# EAGLE design beaconv09 (EAGLE 6.1)
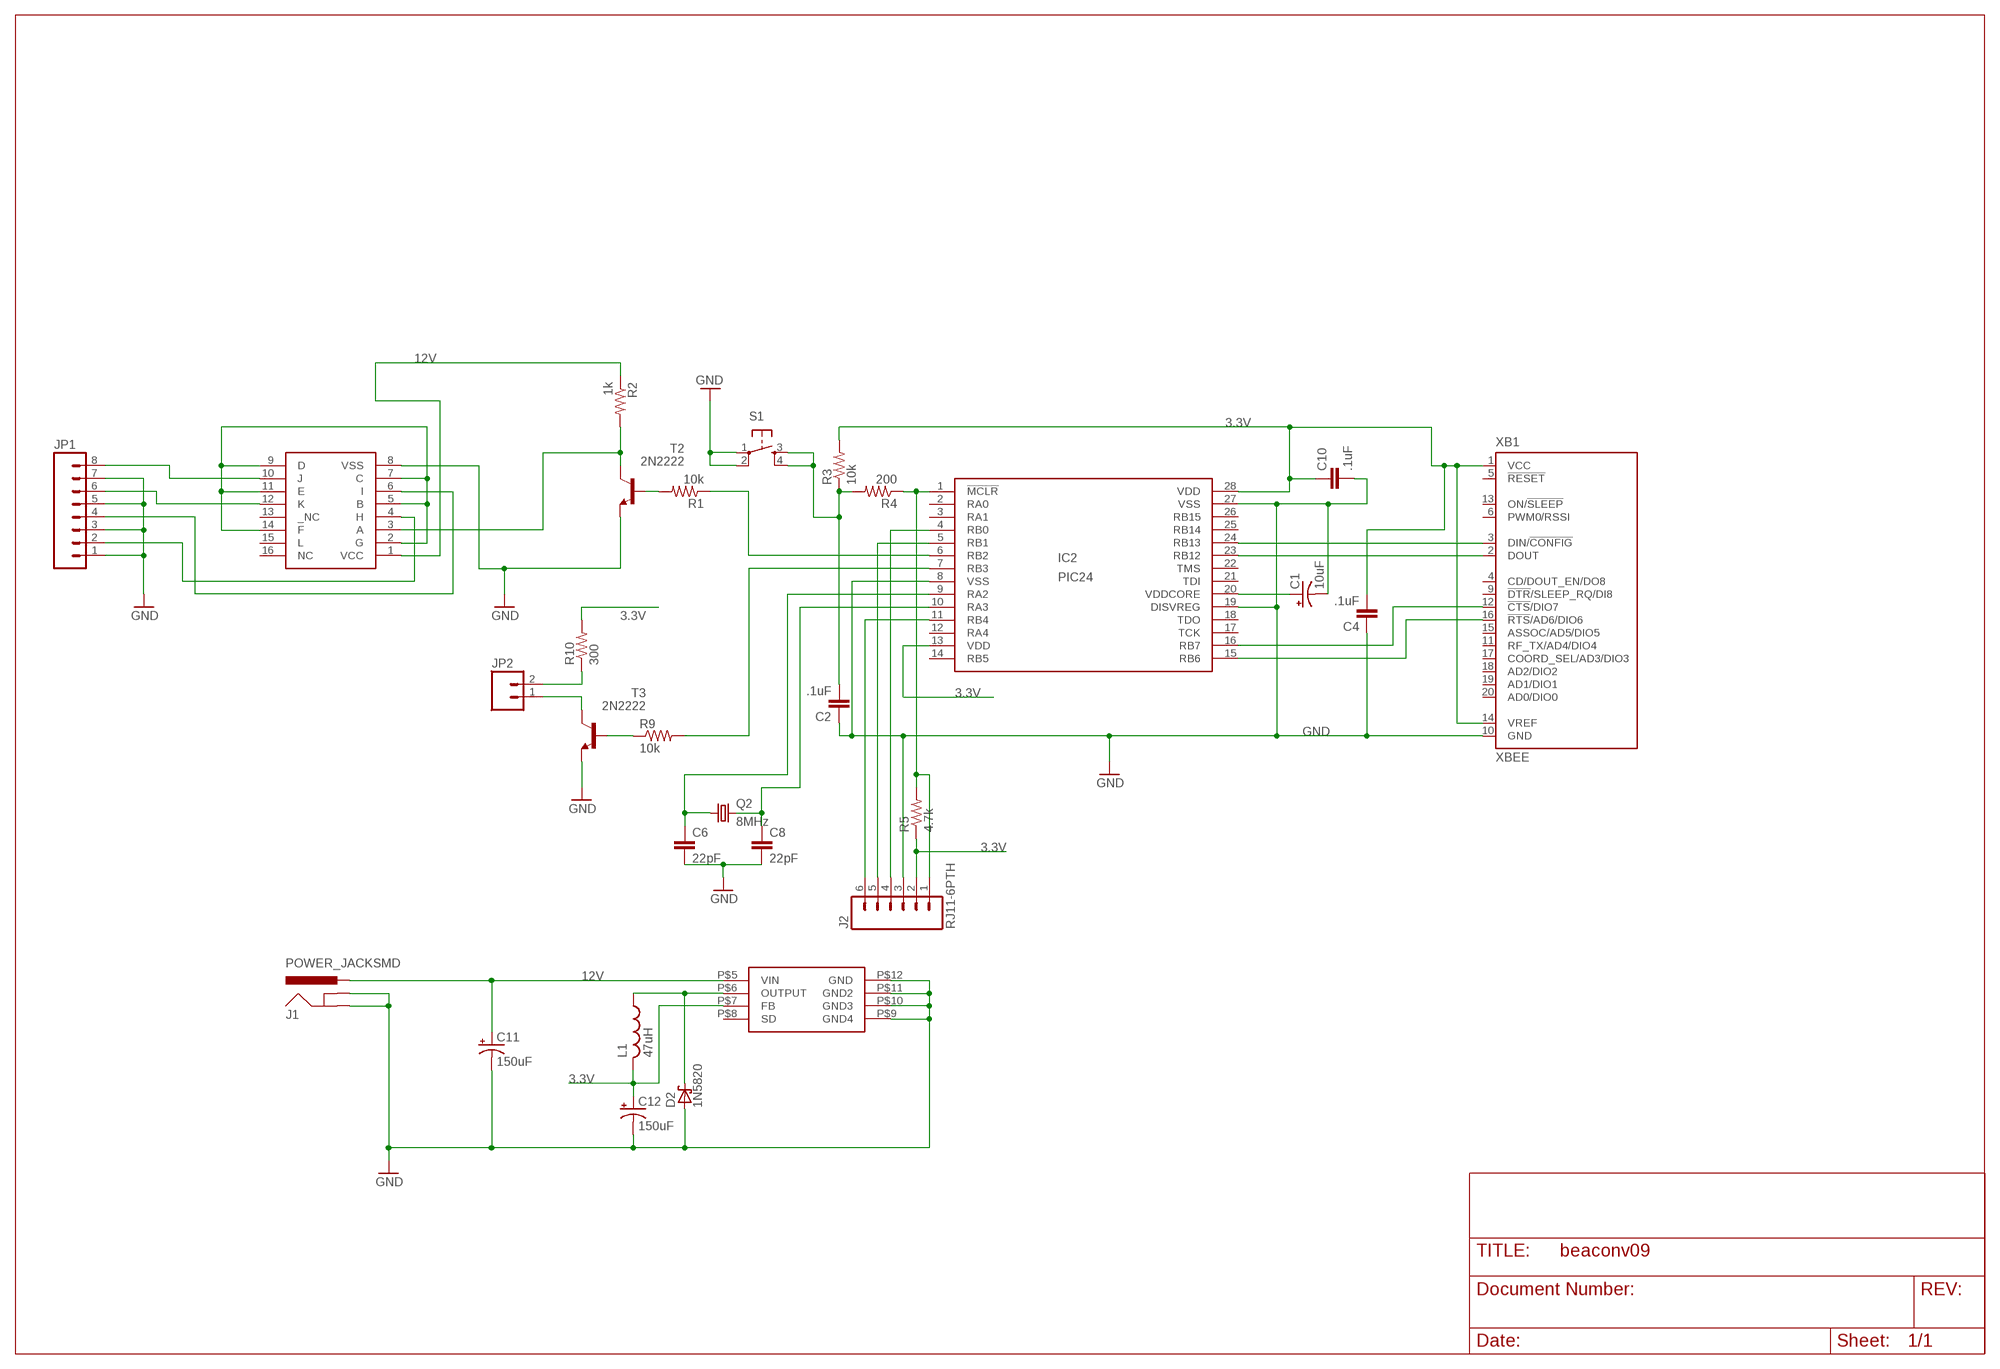
[diagram p0: schematic, sheet 1]

## Parts
AP1509  BUCK1  [BUCK]
C1  10uF  CAP_POL1206  [EIA3216]
C2  .1uF  C-EUC1206  [C1206]
C4  .1uF  C-EUC1206  [C1206]
C6  22pF  C-EUC1206  [C1206]
C8  22pF  C-EUC1206  [C1206]
C10  .1uF  C-EUC1206  [C1206]
C11  150uF  CAP_POL  [ECAPSMPS]
C12  150uF  CAP_POL  [ECAPSMPS]
D2  1N5820  15KEXXD  [DO201T15]
IC2  PIC24  PIC24FJ16GA002  [SO28W]
J1  POWER_JACKSMD  [POWER_JACK_SMD]
J2  RJ11-6PTH  [RJ11-6]
JP1  M08LOCK  [1X08_LOCK]
JP2  M02LOCK  [1X02_LOCK]
L1  47uH  BUCKINDUCTOR  [BUCKINDUCTOR2]
Q2  8MHz  CRYSTALHC49UP  [HC49UP]
R1  10k  RESISTOR1206  [1206]
R2  1k  RESISTOR1206  [1206]
R3  10k  RESISTOR1206  [1206]
R4  200  RESISTOR1206  [1206]
R5  4.7k  R-US_R1206  [R1206]
R9  10k  R-US_R1206  [R1206]
R10  300  R-US_R1206  [R1206]
S1  TAC_SWITCHSMD  [TACTILE_SWITCH_SMD]
T2  2N2222  [TO92-CBE]
T3  2N2222  [TO92-CBE]
U$2  CD4049  [DIL16]
XB1  XBEE  [XBEE]

## Nets
3.3V: AP1509.P$7(FB) C4.2 C10.1 C12.P$1(+) IC2.13(VDD) IC2.28(VDD) J2.2 L1.P$2 R3.2 R5.1 R10.2 XB1.1(VCC) XB1.14(VREF)
12V: AP1509.P$5(VIN) C11.P$1(+) J1.VIN0(PWR) R2.1 U$2.1(VCC)
GND: AP1509.P$9(GND4) AP1509.P$10(GND3) AP1509.P$11(GND2) AP1509.P$12(GND) C1.C(-) C2.1 C4.1 C6.2 C8.2 C10.2 C11.P$2(-) C12.P$2(-) D2.A IC2.8(VSS) IC2.19(DISVREG) IC2.27(VSS) J1.GND(GNDBREAK) J1.P$4(GND) J2.3 JP1.1 JP1.3 JP1.5 JP1.7 S1.1 S1.2 T2.E T3.E U$2.8(VSS) XB1.10(GND)
N$1: IC2.6(RB2) R1.1
N$2: R1.2 T2.B
N$3: JP1.2 U$2.4(H)
N$4: JP2.2 R10.1
N$5: JP1.4 U$2.6(I)
N$6: IC2.23(RB12) XB1.2(DOUT)
N$7: JP1.8 U$2.10(J)
N$8: IC2.24(RB13) XB1.3(DIN/!CONFIG)
N$9: IC2.4(RB0) J2.4
N$10: C1.A(+) IC2.20(VDDCORE)
N$11: C2.2 R3.1 R4.2 S1.3 S1.4
N$12: IC2.1(!MCLR) J2.1 R4.1 R5.2
N$13: IC2.16(RB7) XB1.12(!CTS!/DIO7)
N$14: AP1509.P$6(OUTPUT) D2.C L1.P$1
N$15: R2.2 T2.C U$2.3(A)
N$16: IC2.7(RB3) R9.2
N$17: JP1.6 U$2.12(K)
N$18: JP2.1 T3.C
N$19: IC2.5(RB1) J2.5
N$20: IC2.11(RB4) J2.6
N$21: U$2.2(G) U$2.5(B) U$2.7(C) U$2.9(D) U$2.11(E) U$2.14(F)
N$22: C6.1 IC2.9(RA2) Q2.1
N$23: IC2.15(RB6) XB1.16(!RTS!/AD6/DIO6)
N$24: C8.1 IC2.10(RA3) Q2.2
N$25: R9.1 T3.B
Unconnected: AP1509.P$8(SD) IC2.2(RA0) IC2.3(RA1) IC2.12(RA4) IC2.14(RB5) IC2.17(TCK) IC2.18(TDO) IC2.21(TDI) IC2.22(TMS) IC2.25(RB14) IC2.26(RB15) U$2.13(_NC) U$2.15(L) U$2.16(NC) XB1.4(CD/DOUT_EN/DO8) XB1.5(!RESET) XB1.6(PWM0/RSSI) XB1.9(!DTR!/SLEEP_RQ/DI8) XB1.11(RF_TX/AD4/DIO4) XB1.13(ON/!SLEEP) XB1.15(ASSOC/AD5/DIO5) XB1.17(COORD_SEL/AD3/DIO3) XB1.18(AD2/DIO2) XB1.19(AD1/DIO1) XB1.20(AD0/DIO0)

## Library data of the parts
AP1509 = beacon:BUCK1
C1 = SparkFun-Passives:CAP_POL: Capacitor Polarized These are standard SMD and PTH capacitors. Normally 10uF, 47uF, and 100uF in electrolytic and tantalum varieties. Always verify the external diameter of the through hole cap, it varies with capacity, voltage, and manufacturer. The EIA devices should be standard.
C2 C4 C6 C8 C10 = resistor:C-EU: CAPACITOR, European symbol
C11 C12 = beacon:CAP_POL: Capacitor Polarized These are standard SMD and PTH capacitors. Normally 10uF, 47uF, and 100uF in electrolytic and tantalum varieties. Always verify the external diameter of the through hole cap, it varies with capacity, voltage, and manufacturer. The EIA devices should be standard.
D2 = diode:15KEXXD: DIODE
IC2 = beacon:PIC24FJ16GA002: PIC24FJ16GA002 edit this description Auto generated by make-symbol-device-package-bsdl.ulp Rev. 25 Source: PIC24FJ16GA002.bsd
J1 = SparkFun-Connectors:POWER_JACK: Power Jack This is the standard 5.5mm barrel jack for power. The PTH is the most common, proven, reliable, footprint. All others are experimental. The Slot footprint only works if the mill layer is transmitted to the PCB fab house so be warned. Spark Fun Electronics SKU : PRT-00119. Mating wall wart : TOL-00298 (and others)
J2 = SparkFun-Connectors:RJ11-6: RJ11 Jack Simple 6 pin RJ11 jack. Commonly found on CAT3 devices and Microchip programmers. SKU: PRT-00132
JP1 = SparkFun-Connectors:M08: Header 8 Standard 8-pin 0.1" header. Use with straight break away headers (SKU : PRT-00116), right angle break away headers (PRT-00553), swiss pins (PRT-00743), machine pins (PRT-00117), and female headers (PRT-00115).
JP2 = SparkFun-Connectors:M02: Header 2 Standard 2-pin 0.1" header. Use with straight break away headers (SKU : PRT-00116), right angle break away headers (PRT-00553), swiss pins (PRT-00743), machine pins (PRT-00117), and female headers (PRT-00115). Molex polarized connector foot print use with SKU : PRT-08233 with associated crimp pins and housings.
L1 = beacon:BUCKINDUCTOR
Q2 = crystal:CRYSTAL: CRYSTAL; OC_FARNELL: unknown; OC_NEWARK: unknown
R1-R4 = SparkFun-Passives:RESISTOR: Resistor Basic schematic elements and footprints for 0603, 1206, and PTH resistors.
R5 R9 R10 = rcl:R-US_: RESISTOR, American symbol
S1 = SparkFun-Electromechanical:TAC_SWITCH: Momentary Switch Button commonly used for reset or general input. Spark Fun Electronics SKU : COM-00097
T2 T3 = transistor:2N2222: NPN TRANSISTOR
U$2 = beacon:CD4049
XB1 = maxstream:XBEE: XBee (TM) /XBee-PRO(TM) OEM RF Modules Source: MaxStream, Inc. xbee_productmanual.pdf; MPN: XBP24-Z7UIT-004; OC_FARNELL: 1751799; OC_NEWARK: 34R5507

## Board
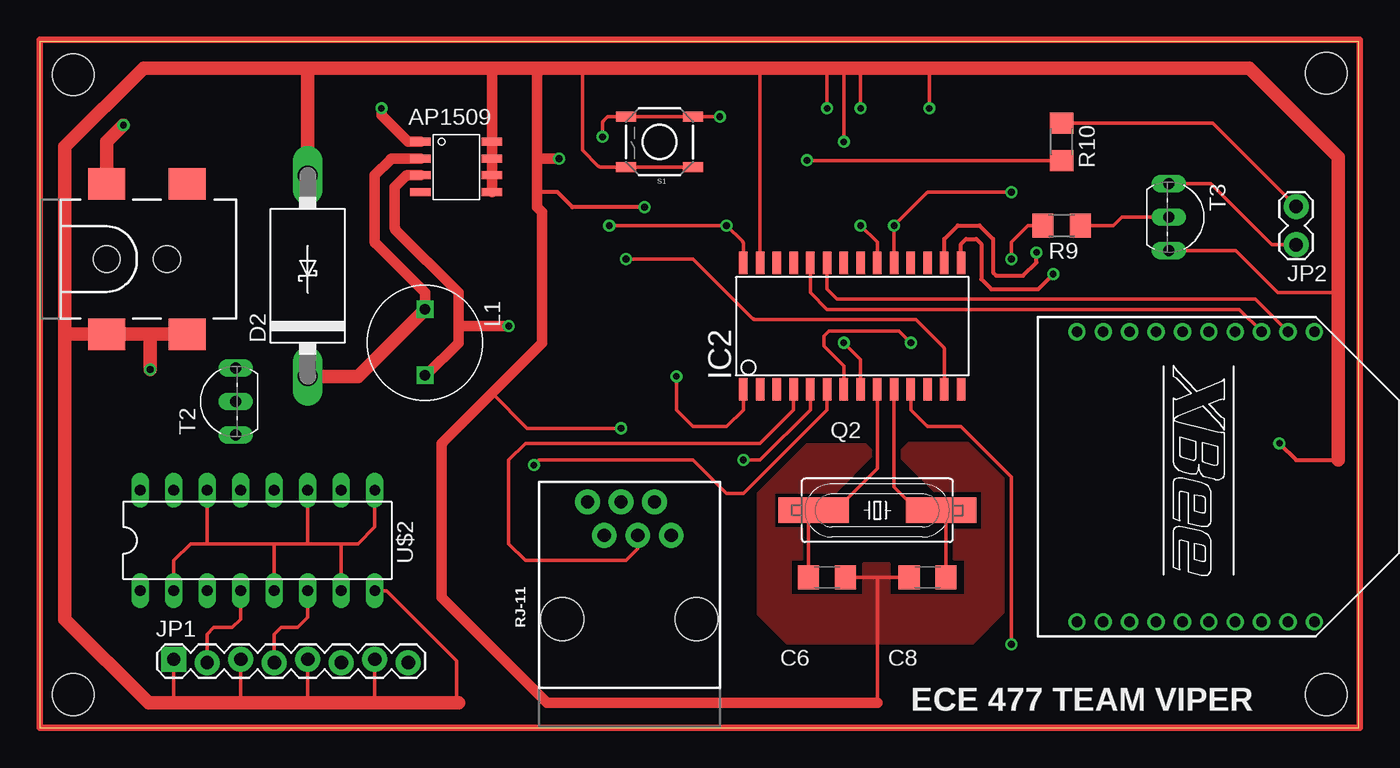
[diagram p1: board, top side]
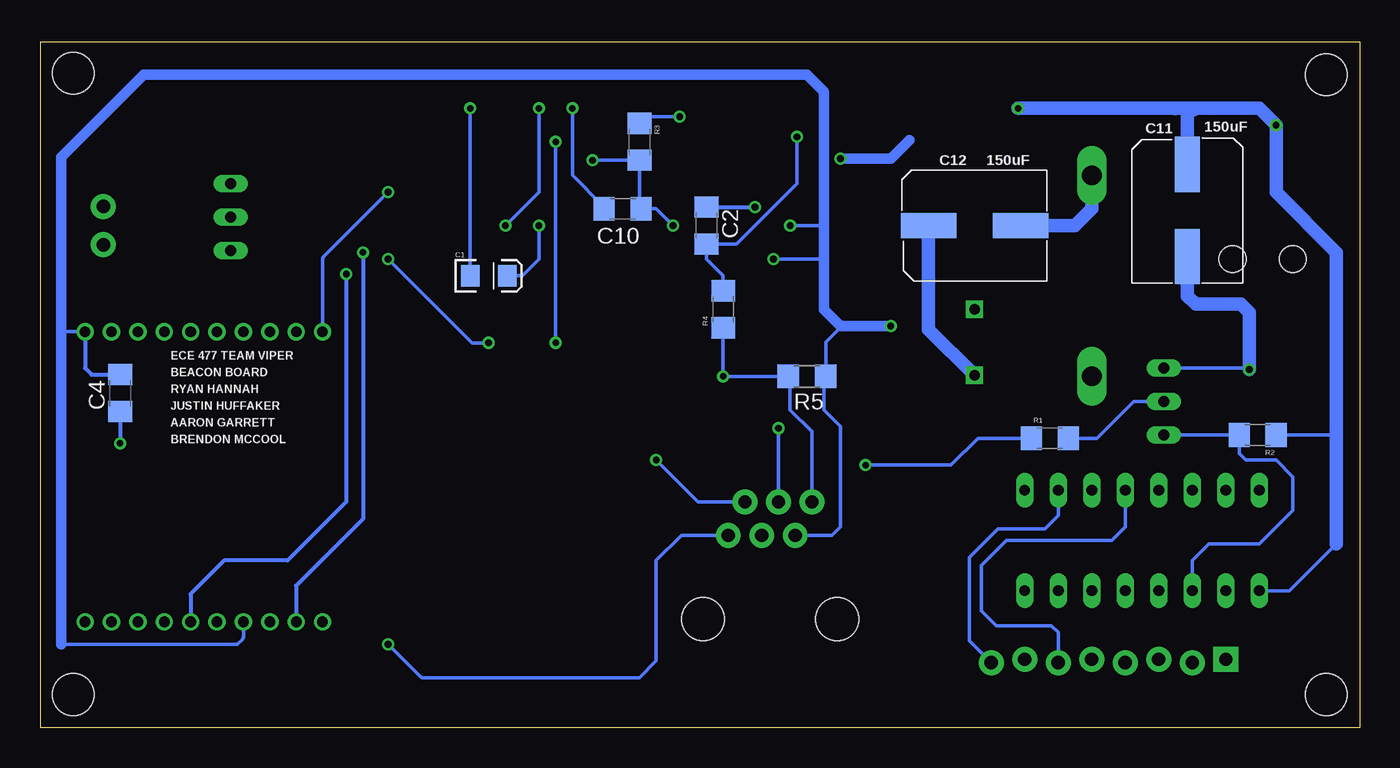
[diagram p2: board, bottom side, seen from below]

Size 100 x 52.06 mm. Coordinates in mm from the lower left corner, seen from the top.
Outline: 0,0 100,0 100,52.06 0,52.06 0,0
Copper layers (1*16): Top 0.035mm / dielectric 1.5mm / Bottom 0.035mm
Design rules: minimum track width 10mil, minimum drill 15mil, track to track 8mil, track to pad 8mil, pad to pad 5mil, via to via 8mil, smd to smd 8mil, copper to edge 40mil, drill to drill 8mil, minimum pad ring 10mil, minimum via ring 8mil, stop-mask expansion 4mil, vias tented up to drill 0mil, thermal gap 10mil
Holes 3.17 mm at 2.54,49.53 97.54,49.66 2.54,2.54 97.54,2.54

### Footprints (pad centres in the part's own frame; a part is rotated, then mirrored left to right if it is on the bottom)
BUCK = smd 1.55 x 0.6: P$5 -2.88,1.27; P$6 -2.88,0; P$7 -2.88,-1.27; P$8 -2.88,-2.54; P$9 2.54,-2.54; P$10 2.54,-1.27; P$11 2.54,0; P$12 2.54,1.27
EIA3216 = smd 1.4 x 1.6: A 1.4,0; C -1.4,0
C1206 = smd 1.6 x 1.8: 1 -1.4,0; 2 1.4,0
ECAPSMPS = smd 4.2 x 1.9: P$1 -3.481,-0.009; P$2 3.496,0.005
DO201T15 = drill 1.499 long: A 7.62,0; C -7.62,0
SO28W = smd 0.65 x 1.7: 1 -7.62,-4.78; 2 -6.35,-4.78; 3 -5.08,-4.78; 4 -3.81,-4.78; 5 -2.54,-4.78; 6 -1.27,-4.78; 7 0,-4.78; 8 1.27,-4.78; 9 2.54,-4.78; 10 3.81,-4.78; 11 5.08,-4.78; 12 6.35,-4.78; 13 7.62,-4.78; 14 8.89,-4.78; 15 8.89,4.78; 16 7.62,4.78; 17 6.35,4.78; 18 5.08,4.78; 19 3.81,4.78; 20 2.54,4.78; 21 1.27,4.78; 22 0,4.78; 23 -1.27,4.78; 24 -2.54,4.78; 25 -3.81,4.78; 26 -5.08,4.78; 27 -6.35,4.78; 28 -7.62,4.78
POWER_JACK_SMD = smd 2.8 x 2.4: GND 0,-5.7; P$4 6.1,-5.7; VIN0 0,5.7; VIN1 6.1,5.7 | hole 2.032: 0,0; 4.572,0
RJ11-6 = drill 1.016 pad 1.88: 1 1.905,8.89; 2 3.175,6.35; 3 4.445,8.89; 4 5.715,6.35; 5 6.985,8.89; 6 8.255,6.35 | hole 3.251: 0,0; 10.16,0
1X08_LOCK = drill 1.016 pad 1.88 square: 1 0,0.127 | drill 1.016 pad 1.88: 2 2.54,-0.127; 3 5.08,0.127; 4 7.62,-0.127; 5 10.16,0.127; 6 12.7,-0.127; 7 15.24,0.127; 8 17.78,-0.127
1X02_LOCK = drill 1.016 pad 1.88: 1 -0.178,0; 2 2.718,0
BUCKINDUCTOR2 = drill 0.8 square: P$1 0,0; P$2 5,0
HC49UP = smd 5.334 x 1.93: 1 -4.826,0; 2 4.826,0
1206 = smd 1.6 x 1.8: 1 -1.4,0; 2 1.4,0
R1206 = smd 1.6 x 1.803: 1 -1.422,0; 2 1.422,0
TACTILE_SWITCH_SMD = smd 1.524 x 0.762: 1 -2.54,1.905; 2 2.54,1.905; 3 -2.54,-1.905; 4 2.54,-1.905
TO92-CBE = drill 0.813 long: B 0,0; C -2.54,0; E 2.54,0
DIL16 = drill 0.813 long: 1 -8.89,-3.81; 2 -6.35,-3.81; 3 -3.81,-3.81; 4 -1.27,-3.81; 5 1.27,-3.81; 6 3.81,-3.81; 7 6.35,-3.81; 8 8.89,-3.81; 9 8.89,3.81; 10 6.35,3.81; 11 3.81,3.81; 12 1.27,3.81; 13 -1.27,3.81; 14 -3.81,3.81; 15 -6.35,3.81; 16 -8.89,3.81
XBEE = drill 0.8 pad 1.27: 1 -11,9; 2 -11,7; 3 -11,5; 4 -11,3; 5 -11,1; 6 -11,-1; 7 -11,-3; 8 -11,-5; 9 -11,-7; 10 -11,-9; 11 11,-9; 12 11,-7; 13 11,-5; 14 11,-3; 15 11,-1; 16 11,1; 17 11,3; 18 11,5; 19 11,7; 20 11,9

### Placement (x,y rotation side)
AP1509  31.75,43.18 0 top
C1  66.04,34.29 0 bottom
C2  49.53,38.1 270 bottom
C4  93.98,25.4 90 bottom
C6  59.69,11.43 0 top
C8  67.31,11.43 180 top
C10  55.88,39.37 180 bottom
C11  13.08,39.24 270 bottom
C12  29.21,38.1 0 bottom
D2  20.32,34.29 90 top
IC2  60.96,30.48 0 top
J1  5.08,35.56 0 top
J2  39.62,8.26 0 top
JP1  10.16,5.08 0 top
JP2  95.25,36.83 90 top
L1  29.21,31.75 270 top
Q2  63.5,16.51 0 top
R1  23.5,21.97 0 bottom
R2  7.75,22.23 180 bottom
R3  54.61,44.45 270 bottom
R4  48.26,31.75 90 bottom
R5  41.91,26.67 180 bottom
R9  77.47,38.1 180 top
R10  77.47,44.45 270 top
S1  46.99,44.45 180 top
T2  14.86,24.77 90 top
T3  85.6,38.73 270 top
U$2  16.51,14.22 0 top
XB1  87.63,19.05 270 top

### Tracks (layer width: path | path; a pad name or v marks a point on that pad's centre or on a via)
3.3V  (via drill 0.51)
  Top 0.254: 31.75,30.48 31.67,30.48 | IC2.28 53.34,36.72 arc45 53.27,36.9 v52.07,38.1 v43.18,38.1 | R10.2 58.23,43.03 arc-45 v58.17,43.05 | IC2.13 68.58,28.72 arc45 68.51,28.9 66.42,30.99 54.21,30.99 arc-45 54.03,31.06 49.53,35.56 v44.45,35.56
  Top 0.813: v35.56,30.48 31.75,30.48 | 31.75,30.48 31.75,33.02 27,37.77 arc-45 26.92,37.95 26.92,41.02 27.74,41.84 arc-45 27.92,41.91 AP1509.P$7 | L1.P$2 29.29,26.75 31.75,29.21 31.75,30.48
  Bottom 0.254: v58.17,43.05 R3.2 54.61,39.5 C10.1 53.34,39.37 v52.07,38.1 | 39.26,30.48 40.41,29.33 arc-45 40.49,29.15 R5.1 40.64,26.52 40.64,24.13 39.37,22.86 39.37,15.24 40,14.61 J2.2 | v43.18,38.1 40.64,38.1 | v44.45,35.56 40.64,35.56 | XB1.14 84.63,6.92 arc45 84.7,6.74 85.09,6.35 98.42,6.35 | XB1.1 98.24,30.05 arc-45 98.42,29.98 98.42,29.97
  Bottom 0.305: XB1.1 96.63,27.29 96.14,26.8 C4.2
  Bottom 0.813: v35.56,30.48 39.26,30.48 arc45 39.44,30.55 40.64,31.75 40.64,35.56 40.64,38.1 40.64,48.15 arc-45 40.71,48.33 41.91,49.53 92.2,49.53 98.42,43.31 98.42,29.97 98.42,6.35
  Bottom 1.016: C12.P$1 32.69,30.23 L1.P$2
12V  (via drill 0.51)
  Top 0.813: v25.91,46.99 25.91,46.48 27.94,44.45 AP1509.P$5
  Top 1.016: J1.VIN0 5.08,44.45 v6.35,45.72
  Bottom 0.254: 1.9,16.38 1.78,16.51 | R2.1 2.03,22.23 1.78,22.48 | U$2.1 5.33,10.41 1.78,13.97
  Bottom 1.016: 1.78,13.97 1.78,16.51 1.78,22.48 1.78,36.07 6.35,40.64 v6.35,45.72 7.62,46.99 12.7,46.99 | 12.7,46.99 13.97,46.99 | 13.97,46.99 v25.91,46.99 | 13.98,46.98 13.97,46.99 | 12.58,46.87 12.7,46.99 | C11.P$1 13.09,46.6 12.7,46.99
GND  (via drill 0.51)
  Top 0.254: JP1.7 25.4,1.9 | JP1.5 20.32,1.9 | JP1.3 15.24,1.9 | JP1.1 10.16,2.16 10.41,1.9 | 31.75,1.9 31.62,2.03 31.62,5.08 26.29,10.41 U$2.8 | 23.62,49.68 arc-45 23.7,49.86 23.88,50.04 | 41.15,50.04 41.15,43.81 42.34,42.62 arc45 42.52,42.54 S1.2 S1.1 | IC2.27 54.61,50.04 | v59.69,46.99 59.69,50.04 | IC2.19 v64.77,38.1 67.24,40.57 arc-45 67.42,40.64 v73.66,40.64 | v62.23,46.99 62.23,50.04 | v60.96,44.45 60.96,50.04 | C6.2 63.5,11.43 | 63.5,11.43 63.5,1.9 63.5,1.78 | 63.5,11.43 C8.2 | 52.07,1.9 52.07,1.78 | 98.14,36.65 arc45 98.32,36.73 98.42,36.83 | v67.44,46.99 67.44,49.81 arc45 67.36,49.98 67.31,50.04 | 98.42,33.02 93.85,33.02 90.68,36.2 T3.E | IC2.8 62.23,27.94 v60.96,29.21 | v44.07,22.73 36.96,22.73 34.29,25.4
  Top 0.305: v45.85,39.5 40.39,39.5 39.24,40.64 37.72,40.64 | v93.98,21.59 95.25,20.32 98.42,20.32
  Top 0.406: 11.2,29.84 J1.P$4 arc45 11.22,29.84
  Top 0.813: 37.72,43.18 37.72,40.64 37.72,39.5 38.1,39.12 38.1,29.21 34.29,25.4 30.55,21.66 arc45 30.48,21.48 30.48,9.91 38.48,1.9 52.07,1.9 63.5,1.9 | 37.72,43.18 37.72,49.55 arc-45 37.79,49.73 38.1,50.04 | v39.37,43.18 37.72,43.18 | AP1509.P$9 AP1509.P$10 AP1509.P$11 AP1509.P$12 34.29,50.04
  Top 1.016: 31.75,1.9 25.4,1.9 20.32,1.9 15.24,1.9 10.41,1.9 8.26,1.9 1.9,8.26 1.9,29.97 | 20.32,50.04 7.87,50.04 1.9,44.07 1.9,29.97 | 20.32,50.04 23.88,50.04 34.29,50.04 38.1,50.04 41.15,50.04 54.61,50.04 59.69,50.04 60.96,50.04 62.23,50.04 67.31,50.04 91.72,50.04 91.72,50.02 98.42,43.31 98.42,36.83 98.42,33.02 98.42,20.32 | D2.A 20.32,50.04 | 1.9,29.97 1.94,29.93 arc45 2.12,29.86 J1.GND 8.38,29.86 | 8.38,29.86 J1.P$4 | v8.38,27.18 8.38,29.86
  Bottom 0.254: C10.2 57.28,39.39 arc-45 57.35,39.57 59.69,41.91 v59.69,46.99 | v64.77,38.1 62.23,40.64 v62.23,46.99 | XB1.10 78.63,35.56 arc45 78.56,35.74 v73.66,40.64 | C1.C v67.44,46.98 arc45 v67.44,46.99 | v60.96,29.21 v60.96,44.45 | J2.3 v44.07,22.73 | T2.E 8.51,27.3 v8.38,27.18
  Bottom 0.305: C2.1 v45.85,39.5 | C4.1 v93.98,21.59
  Bottom 0.813: 34.16,44.58 35.56,43.18 v39.37,43.18
  Bottom 1.016: D2.A 20.32,39.37 21.59,38.1 C12.P$2 | C11.P$2 13.08,32.76 12.45,32.13 9.02,32.13 8.38,31.5 v8.38,27.18
  pour Top (isolate 0.254): 64.39,12.45 64.39,10.03 70.23,10.03 70.23,12.83 69.34,12.83 69.34,14.99 71.5,14.99 71.5,18.03 67.82,18.03 65.41,20.45 65.41,21.08 65.91,21.59 70.36,21.59 73.03,18.92 73.03,8.76 70.74,6.48 56.64,6.48 54.48,8.64 54.48,17.78 58.17,21.46 62.61,21.46 62.99,21.08 62.99,20.57 60.32,17.91 55.63,17.91 55.63,15.11 57.78,15.11 57.78,12.83 56.9,12.83 56.9,10.03 62.48,10.03 62.48,12.45
N$1  (via drill 0.51)
  Top 0.254: IC2.6 59.69,24.13 53.34,17.78 52.07,17.78 49.53,20.32 37.85,20.32 v37.46,19.94
  Bottom 0.254: v37.46,19.94 30.99,19.94 28.96,21.97 R1.1
N$2
  Bottom 0.254: R1.2 19.94,21.97 17.14,24.77 T2.B
N$3
  Top 0.254: U$2.4 15.24,8.26 14.61,7.62 13.21,7.62 12.7,7.11 JP1.2
N$4
  Top 0.254: R10.1 88.93,45.87 JP2.2
N$5
  Top 0.254: U$2.6 20.32,8.38 19.56,7.62 18.29,7.62 17.78,7.11 JP1.4
N$6
  Top 0.254: IC2.23 59.69,33.27 60.45,32.51 92.17,32.51 XB1.2
N$7
  Bottom 0.254: U$2.10 22.86,16.13 23.88,15.11 27.43,15.11 29.59,12.95 29.59,6.6 JP1.8
N$8
  Top 0.254: IC2.24 58.42,33.02 59.69,31.75 90.93,31.75 XB1.3
N$9
  Top 0.254: J2.4 45.34,13.59 44.45,12.7 36.83,12.7 35.56,13.97 35.56,20.32 36.83,21.59 54.61,21.59 57.15,24.13 IC2.4
N$10  (via drill 0.51)
  Top 0.254: v62.23,38.1 63.5,36.83 IC2.20
  Bottom 0.254: C1.A 63.6,34.29 arc-45 63.43,34.36 62.23,35.56 v62.23,38.1
N$11  (via drill 0.51)
  Top 0.254: v51.56,46.35 S1.3 S1.4 43.05,46.35 42.75,46.05 arc45 42.67,45.87 v42.67,44.83
  Bottom 0.254: R4.2 48.26,34.29 49.53,35.56 C2.2 47.35,36.7 arc-45 47.17,36.77 42.67,41.27 v42.67,44.83 | v51.56,46.35 54.1,46.35 R3.1
N$12  (via drill 0.51)
  Top 0.254: IC2.1 53.34,24.13 52.07,22.86 49.53,22.86 48.26,24.13 v48.26,26.67
  Bottom 0.254: R4.1 v48.26,26.67 R5.2 43.18,26.52 43.18,24.13 41.53,22.48 J2.1
N$13  (via drill 0.51)
  Top 0.305: IC2.16 68.58,37.08 69.6,38.1 71.25,38.1 72.26,37.08 72.26,34.54 72.52,34.29 74.55,34.29 75.56,35.31 v75.56,36.07
  Bottom 0.305: v75.56,36.07 75.56,15.88 80.65,10.79 80.65,8.07 XB1.12
N$14
  Top 0.813: L1.P$1 29.21,33.02 25.47,36.76 arc-45 25.4,36.93 25.4,41.91 26.6,43.11 arc-45 26.78,43.18 AP1509.P$6
  Top 1.016: L1.P$1 24.13,26.67 D2.C
N$15
  Bottom 0.254: U$2.3 12.7,12.7 11.43,13.97 7.62,13.97 5.08,16.51 5.08,19.05 6.35,20.32 8.64,20.32 9.14,20.83 R2.2 T2.C
N$16  (via drill 0.51)
  Top 0.254: IC2.7 60.96,27.43 59.44,28.96 59.44,29.72 59.82,30.1 65.15,30.1 v66.04,29.21 | v73.66,35.56 73.66,36.83 74.93,38.1 R9.2
  Bottom 0.254: v66.04,29.21 67.31,29.21 v73.66,35.56
N$17
  Bottom 0.254: U$2.12 17.78,15.24 18.8,14.22 26.8,14.22 28.7,12.32 28.7,8.89 27.56,7.75 23.37,7.75 22.86,7.24 JP1.6
N$18
  Top 0.254: JP2.1 93.4,36.65 88.77,41.27 T3.C
N$19  (via drill 0.51)
  Top 0.254: v53.34,20.32 54.61,20.32 58.42,24.13 IC2.5
  Bottom 0.254: J2.5 50.16,17.14 v53.34,20.32
N$20  (via drill 0.51)
  Top 0.254: v73.66,6.35 73.66,19.05 69.85,22.86 67.42,22.86 arc-45 67.24,22.93 66.04,24.13 IC2.11
  Bottom 0.254: v73.66,6.35 71.19,3.88 arc-45 71.02,3.81 54.61,3.81 53.34,5.08 53.34,12.7 51.43,14.61 J2.6
N$21
  Top 0.254: U$2.2 10.16,12.7 11.43,13.97 12.7,13.97 | 12.7,13.97 17.78,13.97 | 17.78,13.97 20.32,13.97 | 20.32,13.97 22.86,13.97 | 22.86,13.97 24.13,13.97 25.4,15.24 U$2.9 | U$2.14 12.7,13.97 | U$2.7 22.86,13.97 | U$2.5 17.78,13.97 | U$2.11 20.32,13.97
N$22
  Top 0.254: C6.1 58.29,16.13 Q2.1 60.32,16.51 63.5,19.68 IC2.9
N$23  (via drill 0.51)
  Top 0.305: IC2.15 69.85,36.7 70.23,37.08 70.99,37.08 71.37,36.7 71.37,34.04 72.14,33.27 75.69,33.27 v76.84,34.42
  Bottom 0.305: v76.84,34.42 76.84,17.14 81.28,12.7 86.11,12.7 88.65,10.16 88.65,8.07 XB1.16
N$24
  Top 0.254: C8.1 68.71,16.13 Q2.2 66.55,16.51 64.77,18.29 IC2.10
N$25
  Top 0.254: R9.1 81.41,38.1 82.04,38.73 T3.B
N$26
  Top 0.508: 0,52.2 0,0 100.08,0 100.08,52.2 0,52.2

### Text on the board
tPlace: RJ-11 | ECE 477 TEAM VIPER
bPlace: 150uF | C11 | 150uF | C12 | ECE 477 TEAM VIPER | BEACON BOARD | RYAN HANNAH | JUSTIN HUFFAKER | AARON GARRETT | BRENDON MCCOOL